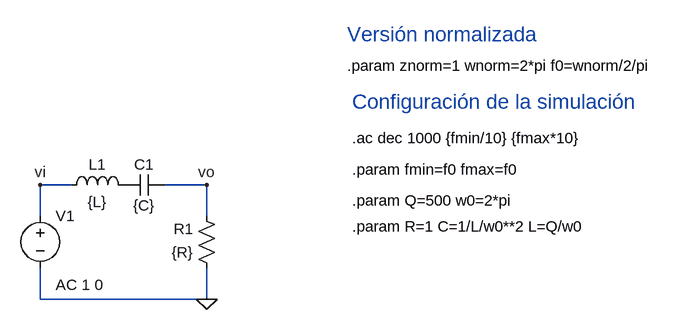
[diagram p0: schematic Draft2.asc]
Draft2.asc, the LTspice schematic file:
Version 4
SHEET 1 908 680
WIRE 0 128 -48 128
WIRE 208 128 144 128
WIRE -48 176 -48 128
WIRE 208 176 208 128
WIRE -48 304 -48 256
WIRE 208 304 208 256
WIRE 208 304 -48 304
FLAG 208 304 0
FLAG 208 128 vo
FLAG -48 128 vi
SYMBOL res 224 272 R180
WINDOW 0 36 76 Left 2
WINDOW 3 36 40 Left 2
SYMATTR InstName R1
SYMATTR Value {R}
SYMBOL ind -16 144 R270
WINDOW 0 32 56 VTop 2
WINDOW 3 5 56 VBottom 2
SYMATTR InstName L1
SYMATTR Value {L}
SYMBOL cap 144 112 R90
WINDOW 0 0 32 VBottom 2
WINDOW 3 32 32 VTop 2
SYMATTR InstName C1
SYMATTR Value {C}
SYMBOL voltage -48 160 R0
WINDOW 123 24 122 Left 2
WINDOW 39 0 0 Left 0
SYMATTR InstName V1
SYMATTR Value ""
SYMATTR Value2 AC 1 0
TEXT 432 152 Left 2 !.param Q=500 w0=2*pi
TEXT 432 56 Left 2 !.ac dec 1000 {fmin/10} {fmax*10}
TEXT 432 0 Left 3 ;Configuración de la simulación
TEXT 432 104 Left 2 !.param fmin=f0 fmax=f0
TEXT 424 -104 Left 3 ;Versión normalizada
TEXT 424 -56 Left 2 !.param znorm=1 wnorm=2*pi f0=wnorm/2/pi
TEXT 432 192 Left 2 !.param R=1 C=1/L/w0**2 L=Q/w0

The netlist it stands for:
* Draft2.asc
R1 0 vo {R}
L1 vi P001 {L}
C1 vo P001 {C}
V1 vi 0 AC 1 0
.param Q=500 w0=2*pi
.ac dec 1000 {fmin/10} {fmax*10}
* Configuración de la simulación
.param fmin=f0 fmax=f0
* Versión normalizada
.param znorm=1 wnorm=2*pi f0=wnorm/2/pi
.param R=1 C=1/L/w0**2 L=Q/w0
.backanno
.end